# EAGLE design l6727a-5v (EAGLE 7.3.0)
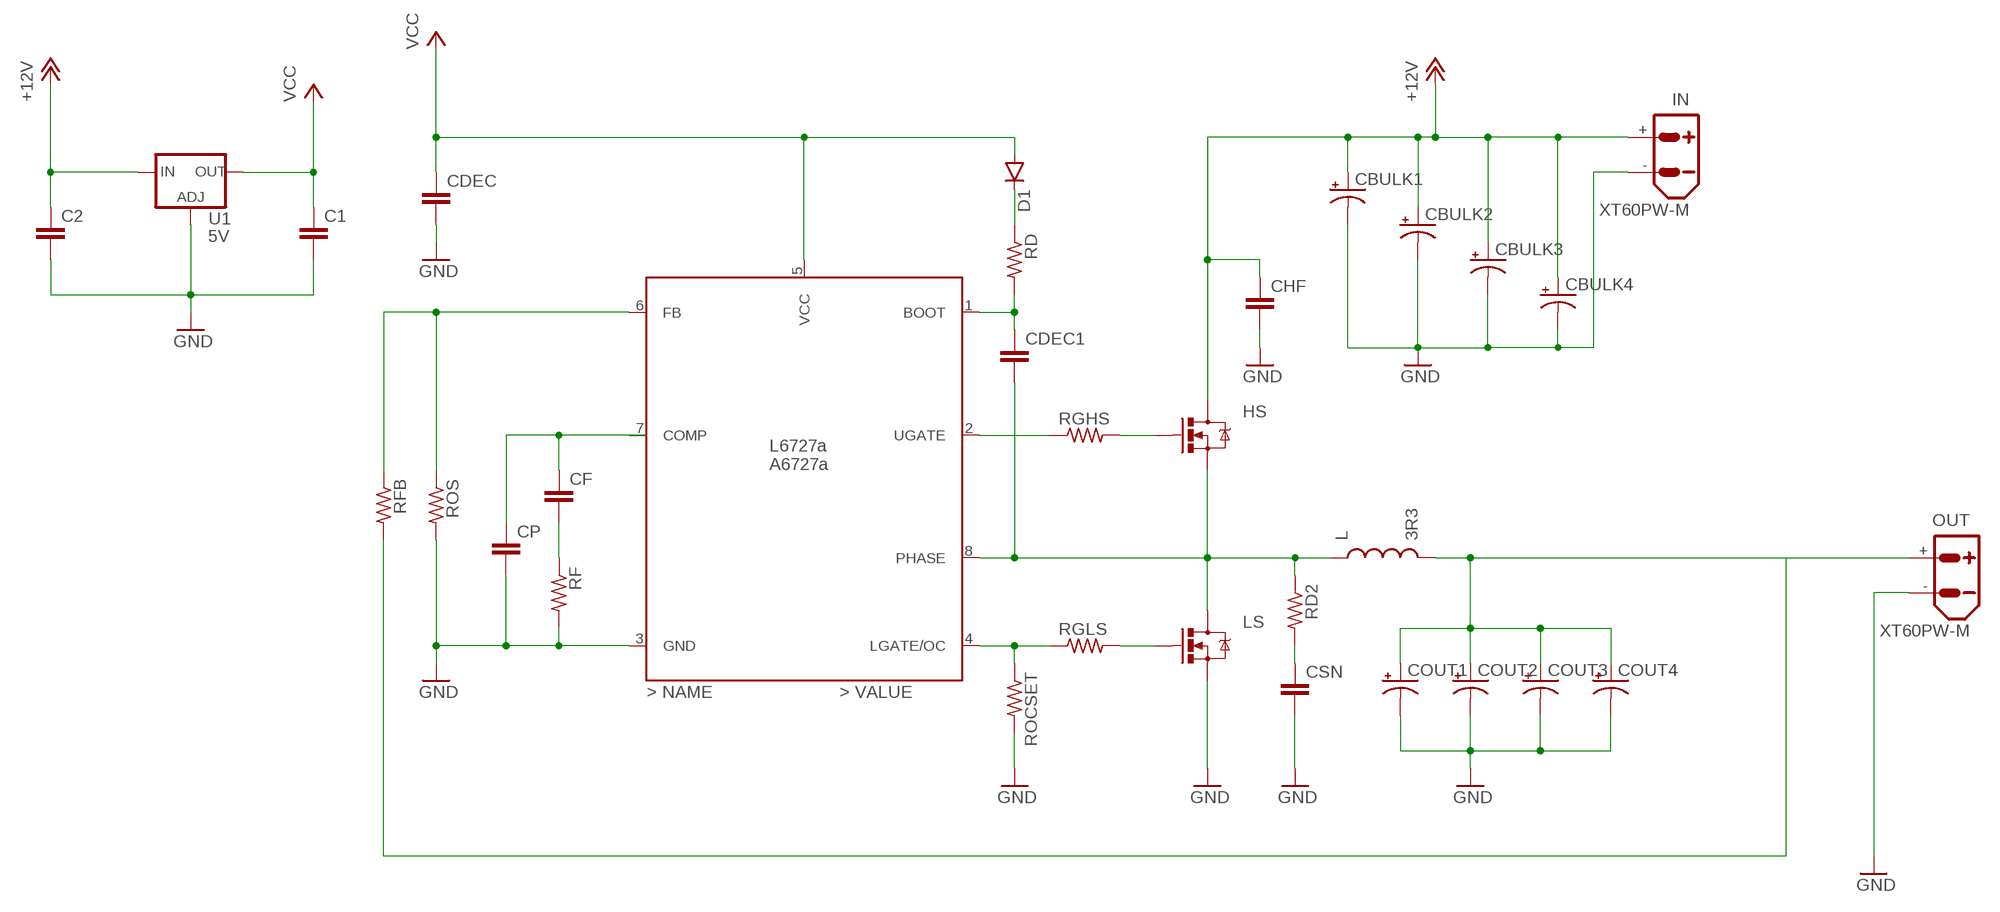
[diagram p0: schematic, sheet 1]

## Parts
C1  C-EUC1206  [C1206]
C2  C-EUC1206  [C1206]
CBULK1  CPOL-USSANYO_SMD_E7  [SANYO-OSCON_SMD_E7]
CBULK2  CPOL-USSANYO_SMD_E7  [SANYO-OSCON_SMD_E7]
CBULK3  CPOL-USSANYO_SMD_E7  [SANYO-OSCON_SMD_E7]
CBULK4  CPOL-USSANYO_SMD_E7  [SANYO-OSCON_SMD_E7]
CDEC  C-EUC1206  [C1206]
CDEC1  C-EUC1206  [C1206]
CF  C-EUC1206  [C1206]
CHF  C-EUC1206  [C1206]
COUT1  CPOL-USSANYO_SMD_E7  [SANYO-OSCON_SMD_E7]
COUT2  CPOL-USSANYO_SMD_E7  [SANYO-OSCON_SMD_E7]
COUT3  CPOL-USSANYO_SMD_E7  [SANYO-OSCON_SMD_E7]
COUT4  CPOL-USSANYO_SMD_E7  [SANYO-OSCON_SMD_E7]
CP  C-EUC1206  [C1206]
CSN  C-EUC1206  [C1206]
D1  DIODESOD123  [SOD-123]
HS  MOSFET-NCHANNELFDS6630A  [SO08]
IC1  L6727A  [SO-08]
IN  XT60PW-M  [XT60PW-M]
L  3R3  INDUCTORSDR13-7-270ML  [INDUCTOR_SDR1307]
LS  MOSFET-NCHANNELFDS6630A  [SO08]
OUT  XT60PW-M  [XT60PW-M]
RD  R-US_R0603  [R0603]
RD2  R-US_R0603  [R0603]
RF  R-US_R0603  [R0603]
RFB  R-US_R0603  [R0603]
RGHS  R-US_R0603  [R0603]
RGLS  R-US_R0603  [R0603]
ROCSET  R-US_R0603  [R0603]
ROS  R-US_R0603  [R0603]
U1  5V  V_REG_317SMD  [SOT223]

## Nets
+12V: C2.1 CBULK1.+ CBULK2.+ CBULK3.+ CBULK4.+ CHF.1 HS.5(D) HS.6(D) HS.7(D) HS.8(D) IN.+ U1.3(IN)
COMP: CF.1 CP.1
FB: IC1.6(FB) RFB.1 ROS.1
GND: C1.2 C2.2 CBULK1.- CBULK2.- CBULK3.- CBULK4.- CDEC.2 CHF.2 COUT1.- COUT2.- COUT3.- COUT4.- CP.2 CSN.2 IC1.3(GND) IN.- LS.1(S) LS.2(S) LS.3(S) OUT.- RF.2 ROCSET.2 ROS.2 U1.1(ADJ)
LGATE: LS.4(G) RGLS.2
LGATE`: IC1.4(LGATE/OC) RGLS.1 ROCSET.1
N$1: D1.C RD.1
N$2: CDEC1.1 IC1.1(BOOT) RD.2
N$3: CF.2 RF.1
PHASE: CDEC1.2 HS.1(S) HS.2(S) HS.3(S) IC1.8(PHASE) L.P$1 LS.5(D) LS.6(D) LS.7(D) LS.8(D) RD2.1
RSN: CSN.1 RD2.2
UGATE: HS.4(G) RGHS.2
UGATE`: IC1.2(UGATE) RGHS.1
VCC: C1.1 CDEC.1 D1.A IC1.5(VCC) U1.2(OUT)
VOUT: COUT1.+ COUT2.+ COUT3.+ COUT4.+ L.P$2 OUT.+ RFB.2
Unconnected: IC1.7(COMP)

## Library data of the parts
C1 C2 CDEC CDEC1 CF CHF CP CSN = rcl:C-EU: CAPACITOR, European symbol
CBULK1-CBULK4 COUT1-COUT4 = rcl:CPOL-US: POLARIZED CAPACITOR, American symbol
D1 = SparkFun-DiscreteSemi:DIODE: Diode These are standard reverse protection diodes and small signal diodes. SMA package can handle up to about 1A. SOD-323 can handle about 200mA. What the SOD-323 package when ordering, there are some mfgs out there that are 5-pin packages.
HS LS = SparkFun-DiscreteSemi:MOSFET-NCHANNEL: Common NMOSFET Parts MFG P/N Store ID Prod ID FDD8780 TRANS-09984 SI7820DN TRANS-11055 FDS6630A IC-08089 2N7002PW TRANS-11151 FQP30N06L COM-10213 TRANS-10060 BSS123LT1G TRANS-08345 BSS138 TRANS-00830 BS170 2N7000; PROD_ID: IC-08089
IC1 = stm-l6727a:L6727A: L6726A is a single-phase step-down controller with integrated high-current drivers that provides complete control logic, protections and reference voltage to realize in an easy and simple way general DC-DC converters by using a compact SO-8 package. Device flexibility allows managing conversions with power input VIN as low as 1.5 V and device supply voltage ranging from 5 V to 12 V
IN OUT = amass:XT60: AMASS XT60 connector Store in Japan AMASS XT60 connector <https://szc.jp/ams-xt60>
L = SparkFun-Passives:INDUCTOR: Inductors Basic Inductor/Choke - 0603 and 1206. Footprints are not proven and vary greatly between part numbers. INDUCTOR POWER 3.3UH 4.0A SMD 0.197" L x 0.197" W x 0.177" H (5.00mm x 5.00mm x 4.50mm); PROD_ID: NDUC-12529; VALUE: 27uH
RD RD2 RF RFB RGHS RGLS ROCSET ROS = rcl:R-US_: RESISTOR, American symbol
U1 = SparkFun-PowerIC:V_REG_317: Voltage Regulator Standard LM317 adjustable voltage regulator. AOI (Adjust Output Input). Google 'LM317 Calculator' for easy to use app to get the two resistor values needed. 240/720 for 5V output. 240/390 for 3.3V output. Spark Fun Electronics SKU : COM-00527

## Board
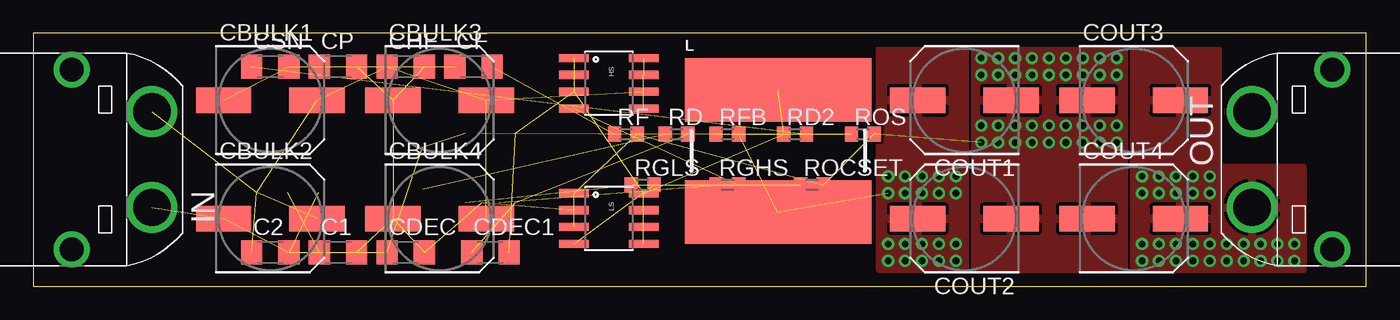
[diagram p1: board, top side]
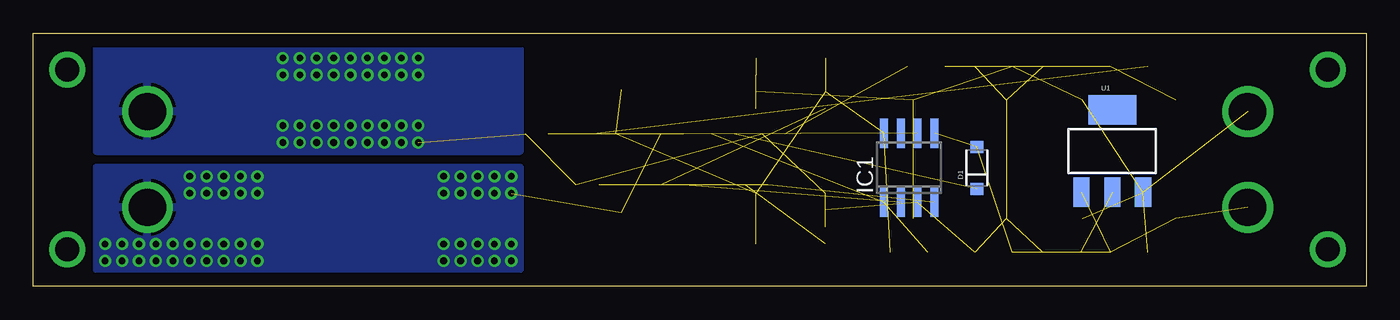
[diagram p2: board, bottom side, seen from below]

Size 100 x 19 mm. Coordinates in mm from the lower left corner, seen from the top.
Outline: 0,0 100,0 100,19 0,19 0,0
Copper layers (1*16): Top 0.035mm / dielectric 1.5mm / Bottom 0.035mm
Design rules "default": minimum track width 10mil, minimum drill 24mil, track to track 8mil, track to pad 8mil, pad to pad 8mil, via to via 8mil, smd to smd 8mil, copper to edge 40mil, drill to drill 8mil, minimum pad ring 10mil, minimum via ring 8mil, stop-mask expansion 4mil, vias tented up to drill 0mil, thermal gap 10mil

### Footprints (pad centres in the part's own frame; a part is rotated, then mirrored left to right if it is on the bottom)
C1206 = smd 1.6 x 1.8: 1 -1.4,0; 2 1.4,0
SANYO-OSCON_SMD_E7 = smd 4.15 x 1.9: + 3.5,0; - -3.5,0
SOD-123 = smd 0.9 x 0.95: A 1.575,0; C -1.575,0
SO08 = smd 0.61 x 2.21: 1 -1.905,-2.616; 2 -0.635,-2.616; 3 0.635,-2.616; 4 1.905,-2.616; 5 1.905,2.616; 6 0.635,2.616; 7 -0.635,2.616; 8 -1.905,2.616
SO-08 = smd 0.6 x 2.2: 1 -1.905,-2.6; 2 -0.635,-2.6; 3 0.635,-2.6; 4 1.905,-2.6; 5 1.905,2.6; 6 0.635,2.6; 7 -0.635,2.6; 8 -1.905,2.6
XT60PW-M = drill 2.8: + 3.6,0; - -3.6,0 | drill 1.8: P$3 -6.75,6; P$4 6.75,6
INDUCTOR_SDR1307 = smd 14 x 4.75: P$1 0,4.6; P$2 0,-4.6
R0603 = smd 1 x 1.1: 1 -0.85,0; 2 0.85,0
SOT223 = smd 1.219 x 2.235: 1 -2.311,-3.099; 2 0,-3.099; 3 2.311,-3.099 | smd 3.6 x 2.2: 4 0,3.099

### Placement (x,y rotation side)
C1  22.86,2.54 0 top
C2  17.78,2.54 0 top
CBULK1  17.78,13.97 0 top
CBULK2  17.78,5.08 0 top
CBULK3  30.48,13.97 0 top
CBULK4  30.48,5.08 0 top
CDEC  27.94,2.54 0 top
CDEC1  34.29,2.54 0 top
CF  33.02,16.51 0 top
CHF  27.94,16.51 0 top
COUT1  69.85,13.97 180 top
COUT2  69.85,5.08 180 top
COUT3  82.55,13.97 0 top
COUT4  82.55,5.08 0 top
CP  22.86,16.51 0 top
CSN  17.78,16.51 0 top
D1  29.21,8.89 90 bottom
HS  43.18,15.24 270 top
IC1  34.29,8.89 0 bottom
IN  8.89,9.53 90 top
L  55.88,10.16 0 top
LS  43.18,5.08 270 top
OUT  91.44,9.53 270 top
RD  48.26,11.43 0 top
RD2  57.15,11.43 0 top
RF  44.45,11.43 0 top
RFB  52.07,11.43 0 top
RGHS  52.07,7.62 0 top
RGLS  45.72,7.62 0 top
ROCSET  58.42,7.62 0 top
ROS  62.23,11.43 0 top
U1  19.05,10.16 0 bottom

### Tracks (layer width: path | path; a pad name or v marks a point on that pad's centre or on a via)
+12V  (11 unrouted)
COMP  (1 unrouted)
FB  (2 unrouted)
GND  (via drill 0.5)  (19 unrouted)
  other vias: 71.12,17.14 71.12,15.88 71.12,12.06 71.12,10.79 72.39,10.79 73.66,10.79 74.93,10.79 76.2,10.79 77.47,10.79 78.74,10.79 80.01,10.79 81.28,10.79 81.28,12.06 80.01,12.06 78.74,12.06 77.47,12.06 76.2,12.06 74.93,12.06 73.66,12.06 72.39,12.06 72.39,15.88 72.39,17.14 73.66,17.14 73.66,15.88 74.93,15.88 74.93,17.14 76.2,17.14 76.2,15.88 77.47,15.88 77.47,17.14 78.74,17.14 78.74,15.88 80.01,15.88 80.01,17.14 81.28,17.14 81.28,15.88
  pour Top (rank 5): 69.85,17.78 82.55,17.78 82.55,1.27 69.85,1.27
  pour Bottom (rank 5): 63.5,17.78 95.25,17.78 95.25,10.16 63.5,10.16
LGATE  (1 unrouted)
LGATE`  (2 unrouted)
N$1  (1 unrouted)
N$2  (2 unrouted)
N$3  (1 unrouted)
PHASE  (10 unrouted)
RSN  (1 unrouted)
UGATE  (1 unrouted)
UGATE`  (1 unrouted)
VCC  (4 unrouted)
VOUT  (via drill 0.5)  (2 unrouted)
  other vias: 64.14,1.91 65.41,1.91 66.67,1.91 67.94,1.91 69.22,1.91 69.22,3.17 67.94,3.17 66.67,3.17 65.41,3.17 64.14,3.17 83.19,1.91 84.45,1.91 85.72,1.91 87,1.91 88.27,1.91 89.53,1.91 90.81,1.91 92.08,1.91 93.34,1.91 94.61,1.91 94.61,3.17 93.34,3.17 92.08,3.17 90.81,3.17 89.53,3.17 88.27,3.17 87,3.17 85.72,3.17 84.45,3.17 83.19,3.17 64.14,8.26 65.41,8.26 66.67,8.26 67.94,8.26 69.22,8.26 69.22,6.99 67.94,6.99 66.67,6.99 65.41,6.99 64.14,6.99 83.19,8.26 84.45,8.26 85.72,8.26 87,8.26 88.27,8.26 88.27,6.99 87,6.99 85.72,6.99 84.45,6.99 83.19,6.99
  pour Top (rank 4): 63.5,17.78 69.85,17.78 69.85,1.27 63.5,1.27
  pour Top (rank 4): 82.55,17.78 82.55,1.27 95.25,1.27 95.25,8.89 88.9,8.89 88.9,17.78
  pour Bottom (rank 4): 63.5,8.89 95.25,8.89 95.25,1.27 63.5,1.27